# EAGLE design ReceiverShield (EAGLE 6.3)
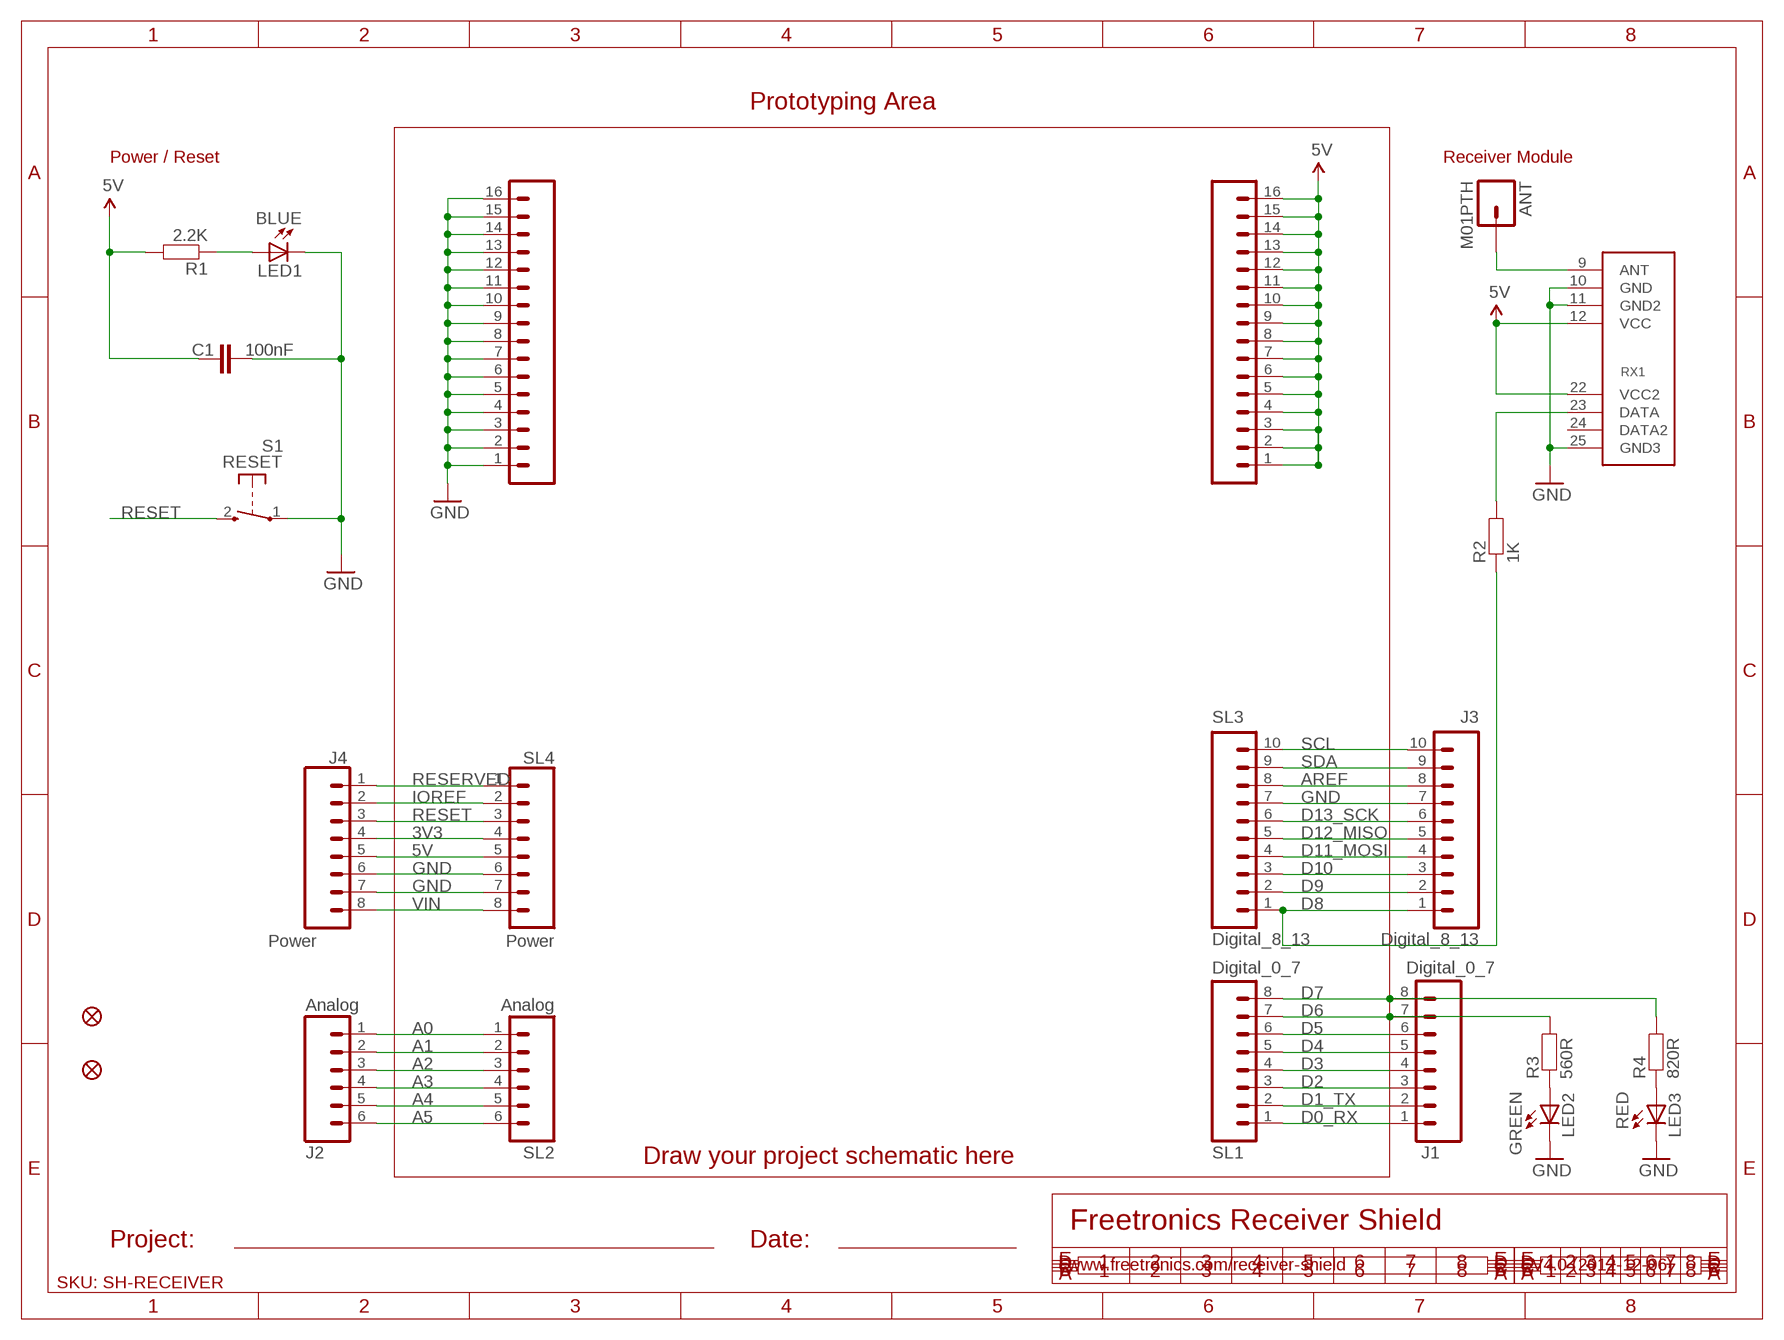
[diagram p0: schematic, sheet 1]

## Parts
ANT  M01PTH  [1X01]
C1  100nF  CAP0603  [0603]
J1  Digital_0_7  M08  [1X08]
J2  Analog  M06SIP  [1X06]
J3  Digital_8_13  M100.1  [1X10]
J4  Power  M08  [1X08]
LED1  BLUE  LED0603  [LED-0603]
LED2  GREEN  LED0603  [LED-0603]
LED3  RED  LED0603  [LED-0603]
PADS_5V  M16PTH  [1X16]
PADS_GND  M16PTH  [1X16]
R1  2.2K  RESISTOR0603  [0603]
R2  1K  RESISTOR0603  [0603]
R3  560R  RESISTOR0603  [0603]
R4  820R  RESISTOR0603  [0603]
RX1  RXB1SIL  [RX-B1]
S1  RESET  TAC_SWITCH_2PIN  [TACTILE_SWITCH_SMD_2PIN_TINY]
SL1  Digital_0_7  M08  [1X08]
SL2  Analog  M06SIP  [1X06]
SL3  Digital_8_13  M100.1  [1X10]
SL4  Power  M08  [1X08]
U$4  FIDUCIAL1X2.5  [FIDUCIAL-1X2.5]
U$5  FIDUCIAL1X2.5  [FIDUCIAL-1X2.5]

## Nets
3V3: J4.4 SL4.4
5V: C1.1 J4.5 PADS_5V.1 PADS_5V.2 PADS_5V.3 PADS_5V.4 PADS_5V.5 PADS_5V.6 PADS_5V.7 PADS_5V.8 PADS_5V.9 PADS_5V.10 PADS_5V.11 PADS_5V.12 PADS_5V.13 PADS_5V.14 PADS_5V.15 PADS_5V.16 R1.2 RX1.12(VCC) RX1.22(VCC2) SL4.5
A0: J2.1 SL2.1
A1: J2.2 SL2.2
A2: J2.3 SL2.3
A3: J2.4 SL2.4
A4: J2.5 SL2.5
A5: J2.6 SL2.6
AREF: J3.8 SL3.8
D0_RX: J1.1 SL1.1
D1_TX: J1.2 SL1.2
D2: J1.3 SL1.3
D3: J1.4 SL1.4
D4: J1.5 SL1.5
D5: J1.6 SL1.6
D6: J1.7 R3.2 SL1.7
D7: J1.8 R4.2 SL1.8
D8: J3.1 R2.1 SL3.1
D9: J3.2 SL3.2
D10: J3.3 SL3.3
D11_MOSI: J3.4 SL3.4
D12_MISO: J3.5 SL3.5
D13_SCK: J3.6 SL3.6
GND: C1.2 J3.7 J4.6 J4.7 LED1.C LED2.C LED3.C PADS_GND.1 PADS_GND.2 PADS_GND.3 PADS_GND.4 PADS_GND.5 PADS_GND.6 PADS_GND.7 PADS_GND.8 PADS_GND.9 PADS_GND.10 PADS_GND.11 PADS_GND.12 PADS_GND.13 PADS_GND.14 PADS_GND.15 PADS_GND.16 RX1.10(GND) RX1.11(GND2) RX1.25(GND3) S1.1(P) SL3.7 SL4.6 SL4.7
IOREF: J4.2 SL4.2
N$1: LED1.A R1.1
N$2: LED2.A R3.1
N$3: LED3.A R4.1
N$6: ANT.1 RX1.9(ANT)
N$135: R2.2 RX1.23(DATA)
RESERVED: J4.1 SL4.1
RESET: J4.3 S1.2(S) SL4.3
SCL: J3.10 SL3.10
SDA: J3.9 SL3.9
VIN: J4.8 SL4.8
Unconnected: RX1.24(DATA2)

## Notes on the sheet
- Prototyping Area
- Power / Reset | Receiver Module
- Draw your project schematic here
- Freetronics Receiver Shield
- Project: | Date:
- www.freetronics.com/receiver-shield | V4.0 (2012-12-06)
- SKU: SH-RECEIVER

## Library data of the parts
ANT = freetronics:M01: Header 1 Standard 1-pin 0.1" header. Use with straight break away headers (SKU : PRT-00116), right angle break away headers (PRT-00553), swiss pins (PRT-00743), machine pins (PRT-00117), and female headers (PRT-00115).
C1 = freetronics:CAP: Capacitor Standard 0603 ceramic capacitor, and 0.1" leaded capacitor.
J1 J4 SL1 SL4 = freetronics:M08: Header 8 Standard 8-pin 0.1" header. Use with straight break away headers (SKU : PRT-00116), right angle break away headers (PRT-00553), swiss pins (PRT-00743), machine pins (PRT-00117), and female headers (PRT-00115).
J2 SL2 = freetronics:M06: Header 6 Standard 6-pin 0.1" header. Use with straight break away headers (SKU : PRT-00116), right angle break away headers (PRT-00553), swiss pins (PRT-00743), machine pins (PRT-00117), and female headers (PRT-00115). Molex polarized connector foot print use with SKU : PRT-08094 with associated crimp pins and housings. NOTES ON THE VARIANTS LOCK and LOCK_LONGPADS... This footprint was designed to help hold the alignment of a through-hole component (i.e. 6-pin header) while soldering it into place. You may notice that each hole has been shifted either up or down by 0.005 of an inch from it's more standard position (which is a perfectly straight line). This slight alteration caused the pins (the squares in the middle) to touch the edges of the holes. Because they are alternating, it causes a "brace" to hold the component in place. 0.005 has proven to be the perfect amount of "off-center" position when using our standard breakaway headers. Although looks a little odd when you look at the bare footprint, once you have a header in there, the alteration is very hard to notice. Also, if you push a header all the way into place, it is covered up entirely on the bottom side. This idea of altering the position of holes to aid alignment will be further integrated into the Sparkfun Library for other footprints. It can help hold any component with 3 or more connection pins.
J3 SL3 = freetronics-original:M10: Header 10 Standard 10-pin 0.1" header. Use with straight break away headers (SKU : PRT-00116), right angle break away headers (PRT-00553), swiss pins (PRT-00743), machine pins (PRT-00117), and female headers (PRT-00115).
LED1-LED3 = freetronics:LED: LEDs Standard schematic elements and footprints for 5mm, 3mm, 1206, and 0603 sized LEDs. 5mm - Spark Fun Electronics SKU : COM-00529 (and others)
PADS_5V PADS_GND = freetronics-2:M16
R1-R4 = freetronics:RESISTOR: Resistor Basic schematic elements and footprints for 0603, 1206, and PTH 1/10th watt (small) resistors.
RX1 = PracticalArduino:RXB1
S1 = freetronics-master-v1:TAC_SWITCH_2PIN: Momentary Tactile Switch - 2 pin
U$4 U$5 = freetronics-original:FIDUCIAL: Fiducial Alignment Points Various fiducial points for machine vision alignment.

## Board
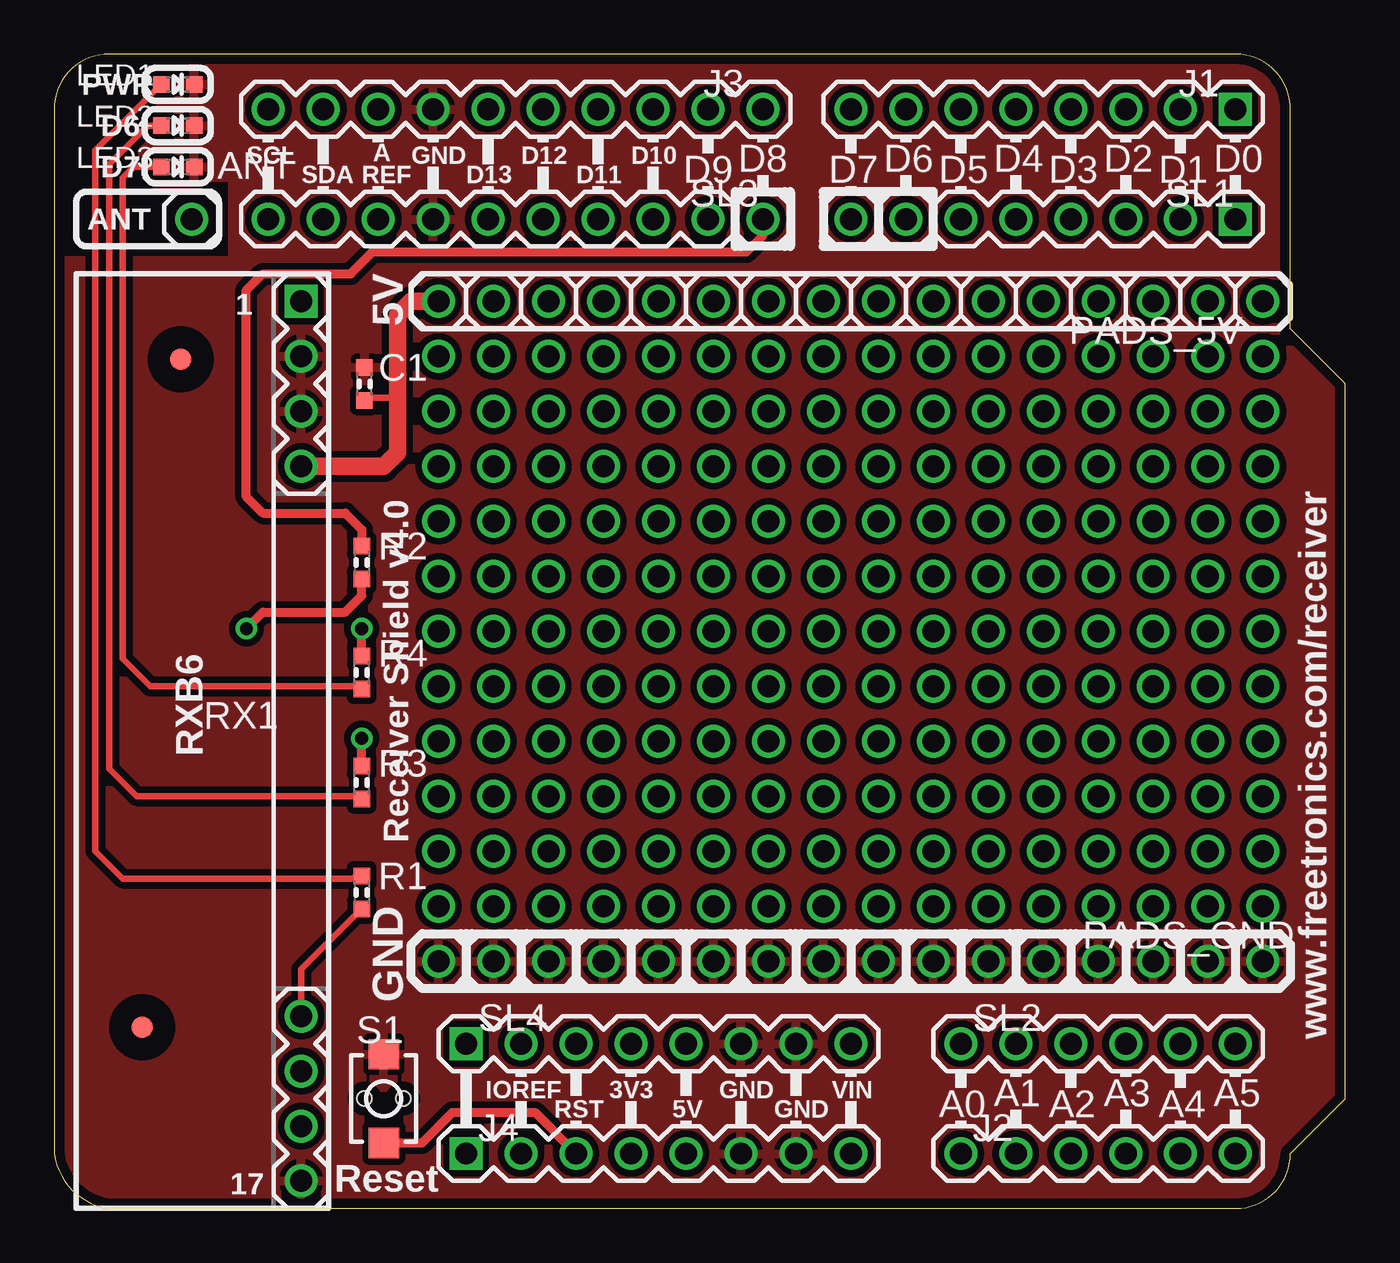
[diagram p1: board, top side]
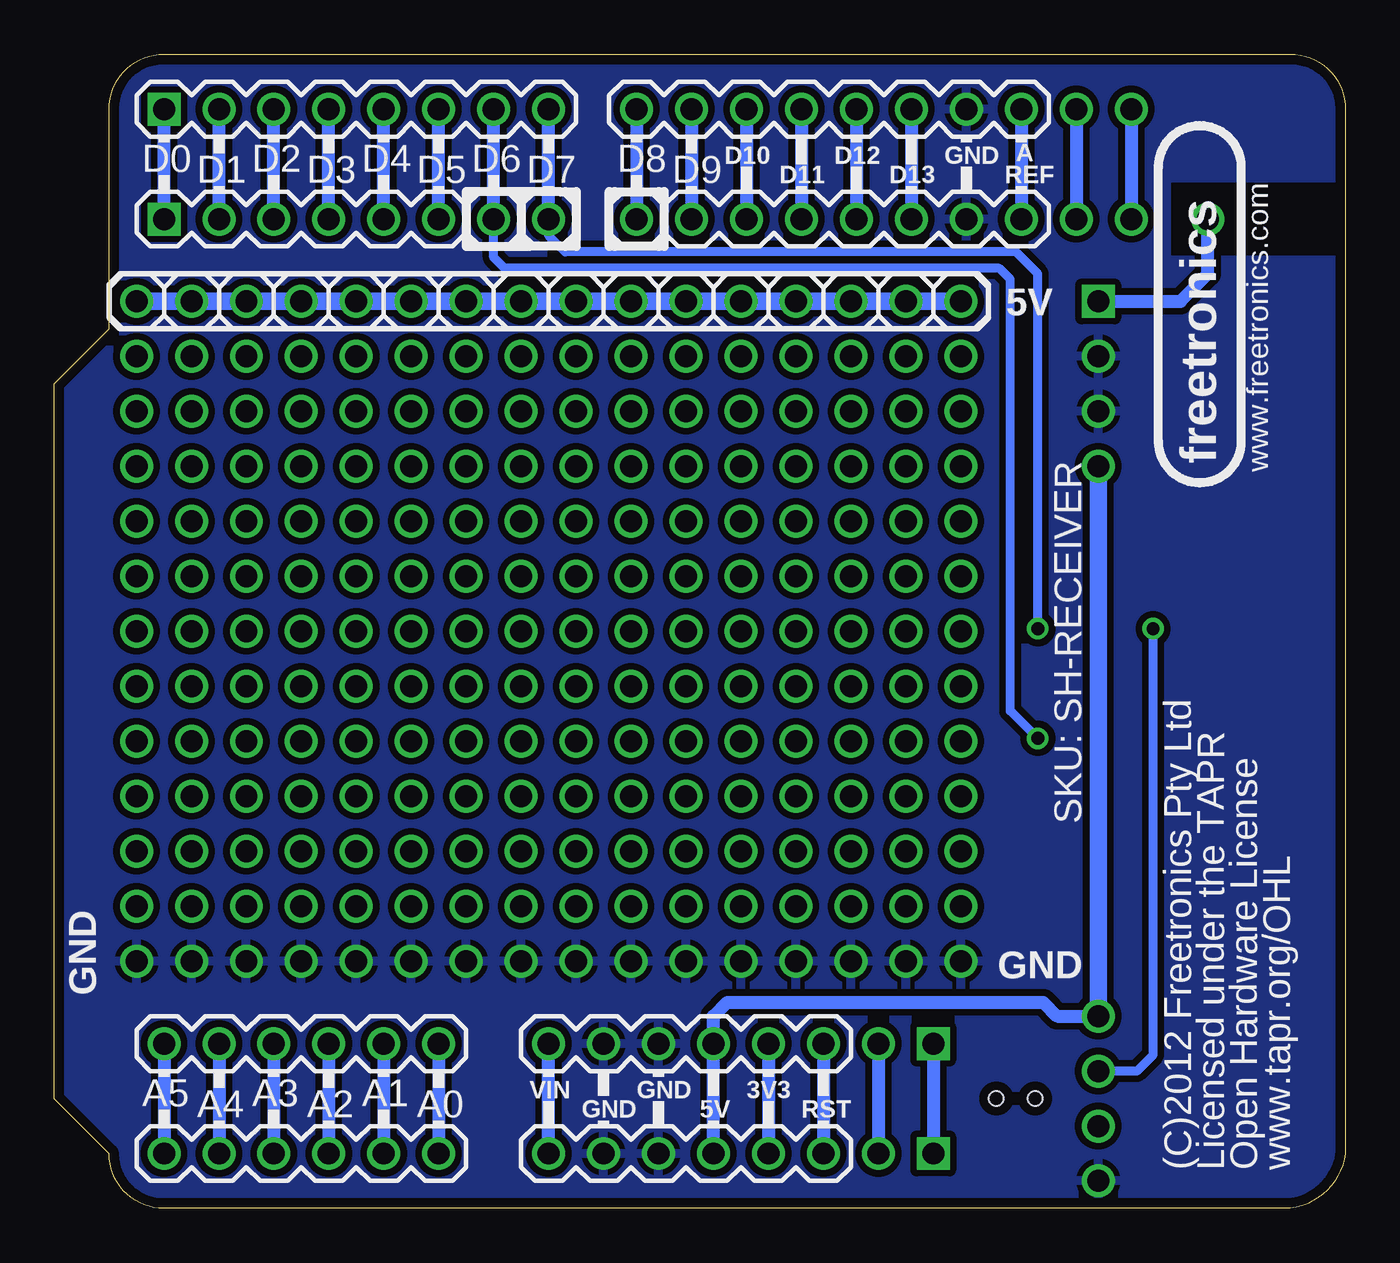
[diagram p2: board, bottom side, seen from below]

Size 59.69 x 53.34 mm. Coordinates in mm from the lower left corner, seen from the top.
Outline: 0,2.54 arc74 2.54,0 54.61,0 arc90 57.15,2.54 59.69,5.08 59.69,38.1 57.15,40.64 57.15,50.8 arc90 54.61,53.34 2.54,53.34 arc90 0,50.8 0,2.54
Copper layers (1*16): Top 0.035mm / dielectric 1.5mm / Bottom 0.035mm
Design rules "default *": minimum track width 10mil, minimum drill 24mil, track to track 12mil, track to pad 12mil, pad to pad 12mil, via to via 12mil, smd to smd 8mil, copper to edge 18mil, drill to drill 8mil, minimum pad ring 10mil, minimum via ring 8mil, stop-mask expansion 4mil, vias tented up to drill 0mil, thermal gap 10mil
tRestrict: area 4.8,38.2 to 6.9,40.3; area 3,7.4 to 5.1,9.4

### Footprints (pad centres in the part's own frame; a part is rotated, then mirrored left to right if it is on the bottom)
1X01 = drill 1.016: 1 0,0
0603 = smd 0.762 x 0.762: 1 -0.762,0; 2 0.762,0
1X08 = drill 1.016 square: 1 0,0 | drill 1.016: 2 2.54,0; 3 5.08,0; 4 7.62,0; 5 10.16,0; 6 12.7,0; 7 15.24,0; 8 17.78,0
1X06 = drill 1.016: 1 0,0; 2 2.54,0; 3 5.08,0; 4 7.62,0; 5 10.16,0; 6 12.7,0
1X10 = drill 1.016: 1 0,0; 2 2.54,0; 3 5.08,0; 4 7.62,0; 5 10.16,0; 6 12.7,0; 7 15.24,0; 8 17.78,0; 9 20.32,0; 10 22.86,0
LED-0603 = smd 0.762 x 0.762: A -0.762,0; C 0.762,0
1X16 = drill 1.016: 1 0,0; 2 2.54,0; 3 5.08,0; 4 7.62,0; 5 10.16,0; 6 12.7,0; 7 15.24,0; 8 17.78,0; 9 20.32,0; 10 22.86,0; 11 25.4,0; 12 27.94,0; 13 30.48,0; 14 33.02,0; 15 35.56,0; 16 38.1,0
RX-B1 = drill 1.016 square: 9 -19.05,0 | drill 1.016: 10 -16.51,0; 11 -13.97,0; 12 -11.43,0; 22 13.97,0; 23 16.51,0; 24 19.05,0; 25 21.59,0
TACTILE_SWITCH_SMD_2PIN_TINY = smd 1.4 x 1.4: 1 -2.05,0; 2 2.05,0 | hole 0.65: 0,0.9; 0,-0.9
FIDUCIAL-1X2.5 = smd 1 x 1: 1 0,0

### Placement (x,y rotation side)
ANT  6.35,45.72 0 top
C1  14.35,38.1 90 top
J1  54.61,50.8 180 top
J2  41.91,2.54 0 top
J3  32.77,50.8 180 top
J4  19.05,2.54 0 top
LED1  5.71,51.94 0 top
LED2  5.71,50.04 0 top
LED3  5.71,48.13 0 top
PADS_5V  55.88,41.91 180 top
PADS_GND  55.88,11.43 180 top
R1  14.22,14.61 270 top
R2  14.22,29.84 270 top
R3  14.22,19.68 90 top
R4  14.22,24.77 90 top
RX1  11.43,22.86 270 top
S1  15.24,5.08 270 top
SL1  54.61,45.72 180 top
SL2  41.91,7.62 0 top
SL3  32.77,45.72 180 top
SL4  19.05,7.62 0 top
U$4  5.84,39.24 0 top
U$5  4.06,8.38 0 top

### Tracks (layer width: path | path; a pad name or v marks a point on that pad's centre or on a via)
3V3
  Bottom 0.61: SL4.4 J4.4
5V
  Top 0.305: R1.2 11.43,11.05 RX1.22 | C1.1 14.48,37.47 15.88,37.47
  Top 0.813: RX1.12 15.24,34.29 15.88,34.92 15.88,37.47 15.88,41.27 16.51,41.91 PADS_5V.16
  Bottom 0.61: J4.5 SL4.5 29.21,8.89 28.57,9.53 13.97,9.53 13.34,8.89 RX1.22
  Bottom 0.813: PADS_5V.16 PADS_5V.15 PADS_5V.14 PADS_5V.13 PADS_5V.12 PADS_5V.11 PADS_5V.10 PADS_5V.9 PADS_5V.8 PADS_5V.7 PADS_5V.6 PADS_5V.5 PADS_5V.4 PADS_5V.3 PADS_5V.2 PADS_5V.1 | RX1.22 RX1.12
A0
  Bottom 0.61: SL2.1 J2.1
A1
  Bottom 0.61: SL2.2 J2.2
A2
  Bottom 0.61: SL2.3 J2.3
A3
  Bottom 0.61: SL2.4 J2.4
A4
  Bottom 0.61: SL2.5 J2.5
A5
  Bottom 0.61: SL2.6 J2.6
AREF
  Bottom 0.61: J3.8 SL3.8
D0_RX
  Bottom 0.61: SL1.1 J1.1
D1_TX
  Bottom 0.61: SL1.2 J1.2
D2
  Bottom 0.61: SL1.3 J1.3
D3
  Bottom 0.61: SL1.4 J1.4
D4
  Bottom 0.61: SL1.5 J1.5
D5
  Bottom 0.61: SL1.6 J1.6
D6  (via drill 0.6)
  Top 0.406: R3.2 v14.22,21.72
  Bottom 0.406: SL1.7 39.37,43.94 38.86,43.43 16,43.43 15.49,42.93 15.49,22.99 v14.22,21.72
  Bottom 0.61: SL1.7 J1.7
D7  (via drill 0.6)
  Top 0.406: R4.2 v14.22,26.8
  Bottom 0.406: v14.22,26.8 14.22,43.18 15.24,44.2 36.07,44.2 36.83,44.96 SL1.8
  Bottom 0.61: SL1.8 J1.8
D8
  Top 0.406: R2.1 14.22,31.37 13.46,32.13 9.65,32.13 8.89,32.89 8.89,42.42 9.65,43.18 13.72,43.18 14.73,44.2 32,44.2 32.77,44.96 SL3.1
  Bottom 0.61: J3.1 SL3.1
D9
  Bottom 0.61: J3.2 SL3.2
D10
  Bottom 0.61: J3.3 SL3.3
D11_MOSI
  Bottom 0.61: J3.4 SL3.4
D12_MISO
  Bottom 0.61: J3.5 SL3.5
D13_SCK
  Bottom 0.61: J3.6 SL3.6
GND
  pour Bottom: 0,43.81 8.26,43.81 8.26,47.62 0,47.62 0,50.8 arc-90 2.54,53.34 54.61,53.34 arc-74 57.15,50.8 57.15,40.64 59.69,38.1 59.69,5.08 57.15,2.54 arc-74 54.61,0 2.54,0 arc-74 0,2.54
  pour Top: 0,43.81 8.26,43.81 8.26,47.62 0,47.62 0,50.8 arc-90 2.54,53.34 54.61,53.34 arc-74 57.15,50.8 57.15,40.64 59.69,38.1 59.69,5.08 57.15,2.54 arc-74 54.61,0 2.54,0 arc-74 0,2.54
IOREF
  Bottom 0.61: SL4.2 J4.2
N$1
  Top 0.305: LED1.A 1.91,48.9 1.91,16.51 3.17,15.24 13.72,15.24 R1.1
N$2
  Top 0.305: LED2.A 4.32,50.04 2.54,48.26 2.54,20.32 3.81,19.05 14.1,19.05 R3.1
N$3
  Top 0.305: LED3.A 3.68,48.13 3.17,47.62 3.17,25.4 4.45,24.13 14.1,24.13 R4.1
N$4  (via drill 1.02)
  other vias: 50.8,34.29
N$5  (via drill 1.02)
  other vias: 50.8,13.97
N$6
  Bottom 0.61: RX1.9 7.62,41.91 6.35,43.18 ANT.1
N$7  (via drill 1.02)
  other vias: 48.26,13.97
N$8  (via drill 1.02)
  other vias: 45.72,13.97
N$9  (via drill 1.02)
  other vias: 43.18,13.97
N$10  (via drill 1.02)
  other vias: 40.64,13.97
N$11  (via drill 1.02)
  other vias: 38.1,13.97
N$12  (via drill 1.02)
  other vias: 35.56,13.97
N$13  (via drill 1.02)
  other vias: 33.02,13.97
N$14  (via drill 1.02)
  other vias: 30.48,13.97
N$15  (via drill 1.02)
  other vias: 27.94,13.97
N$16  (via drill 1.02)
  other vias: 25.4,13.97
N$17  (via drill 1.02)
  other vias: 22.86,13.97
N$18  (via drill 1.02)
  other vias: 20.32,13.97
N$19  (via drill 1.02)
  other vias: 17.78,13.97
N$22  (via drill 1.02)
  other vias: 50.8,16.51
N$23  (via drill 1.02)
  other vias: 48.26,16.51
N$24  (via drill 1.02)
  other vias: 45.72,16.51
N$25  (via drill 1.02)
  other vias: 43.18,16.51
N$26  (via drill 1.02)
  other vias: 40.64,16.51
N$27  (via drill 1.02)
  other vias: 38.1,16.51
N$28  (via drill 1.02)
  other vias: 35.56,16.51
N$29  (via drill 1.02)
  other vias: 33.02,16.51
N$30  (via drill 1.02)
  other vias: 30.48,16.51
N$31  (via drill 1.02)
  other vias: 27.94,16.51
N$32  (via drill 1.02)
  other vias: 25.4,16.51
N$33  (via drill 1.02)
  other vias: 22.86,16.51
N$34  (via drill 1.02)
  other vias: 20.32,16.51
N$35  (via drill 1.02)
  other vias: 17.78,16.51
N$38  (via drill 1.02)
  other vias: 50.8,19.05
N$39  (via drill 1.02)
  other vias: 48.26,19.05
N$40  (via drill 1.02)
  other vias: 45.72,19.05
N$41  (via drill 1.02)
  other vias: 43.18,19.05
N$42  (via drill 1.02)
  other vias: 40.64,19.05
N$43  (via drill 1.02)
  other vias: 38.1,19.05
N$44  (via drill 1.02)
  other vias: 35.56,19.05
N$45  (via drill 1.02)
  other vias: 33.02,19.05
N$46  (via drill 1.02)
  other vias: 30.48,19.05
N$47  (via drill 1.02)
  other vias: 27.94,19.05
N$48  (via drill 1.02)
  other vias: 25.4,19.05
N$49  (via drill 1.02)
  other vias: 22.86,19.05
N$50  (via drill 1.02)
  other vias: 20.32,19.05
N$51  (via drill 1.02)
  other vias: 17.78,19.05
N$54  (via drill 1.02)
  other vias: 50.8,21.59
N$55  (via drill 1.02)
  other vias: 48.26,21.59
N$56  (via drill 1.02)
  other vias: 45.72,21.59
N$57  (via drill 1.02)
  other vias: 43.18,21.59
N$58  (via drill 1.02)
  other vias: 40.64,21.59
N$59  (via drill 1.02)
  other vias: 38.1,21.59
N$60  (via drill 1.02)
  other vias: 35.56,21.59
N$61  (via drill 1.02)
  other vias: 33.02,21.59
N$62  (via drill 1.02)
  other vias: 30.48,21.59
N$63  (via drill 1.02)
  other vias: 27.94,21.59
N$64  (via drill 1.02)
  other vias: 25.4,21.59
N$65  (via drill 1.02)
  other vias: 22.86,21.59
N$66  (via drill 1.02)
  other vias: 20.32,21.59
N$67  (via drill 1.02)
  other vias: 17.78,21.59
N$70  (via drill 1.02)
  other vias: 50.8,24.13
N$71  (via drill 1.02)
  other vias: 48.26,24.13
N$72  (via drill 1.02)
  other vias: 45.72,24.13
N$73  (via drill 1.02)
  other vias: 43.18,24.13
N$74  (via drill 1.02)
  other vias: 40.64,24.13
N$75  (via drill 1.02)
  other vias: 38.1,24.13
N$76  (via drill 1.02)
  other vias: 35.56,24.13
N$77  (via drill 1.02)
  other vias: 33.02,24.13
N$78  (via drill 1.02)
  other vias: 30.48,24.13
N$79  (via drill 1.02)
  other vias: 27.94,24.13
N$80  (via drill 1.02)
  other vias: 25.4,24.13
N$81  (via drill 1.02)
  other vias: 22.86,24.13
N$82  (via drill 1.02)
  other vias: 20.32,24.13
N$83  (via drill 1.02)
  other vias: 17.78,24.13
N$86  (via drill 1.02)
  other vias: 50.8,26.67
N$87  (via drill 1.02)
  other vias: 48.26,26.67
N$88  (via drill 1.02)
  other vias: 45.72,26.67
N$89  (via drill 1.02)
  other vias: 43.18,26.67
N$90  (via drill 1.02)
  other vias: 40.64,26.67
N$91  (via drill 1.02)
  other vias: 38.1,26.67
N$92  (via drill 1.02)
  other vias: 35.56,26.67
N$93  (via drill 1.02)
  other vias: 33.02,26.67
N$94  (via drill 1.02)
  other vias: 30.48,26.67
N$95  (via drill 1.02)
  other vias: 27.94,26.67
N$96  (via drill 1.02)
  other vias: 25.4,26.67
N$97  (via drill 1.02)
  other vias: 22.86,26.67
N$98  (via drill 1.02)
  other vias: 20.32,26.67
N$99  (via drill 1.02)
  other vias: 17.78,26.67
N$102  (via drill 1.02)
  other vias: 50.8,29.21
N$103  (via drill 1.02)
  other vias: 48.26,29.21
N$104  (via drill 1.02)
  other vias: 45.72,29.21
N$105  (via drill 1.02)
  other vias: 43.18,29.21
N$106  (via drill 1.02)
  other vias: 40.64,29.21
N$107  (via drill 1.02)
  other vias: 38.1,29.21
N$108  (via drill 1.02)
  other vias: 35.56,29.21
N$109  (via drill 1.02)
  other vias: 33.02,29.21
N$110  (via drill 1.02)
  other vias: 30.48,29.21
N$111  (via drill 1.02)
  other vias: 27.94,29.21
N$112  (via drill 1.02)
  other vias: 25.4,29.21
N$113  (via drill 1.02)
  other vias: 22.86,29.21
N$114  (via drill 1.02)
  other vias: 20.32,29.21
N$115  (via drill 1.02)
  other vias: 17.78,29.21
N$118  (via drill 1.02)
  other vias: 50.8,31.75
N$119  (via drill 1.02)
  other vias: 48.26,31.75
N$120  (via drill 1.02)
  other vias: 45.72,31.75
N$121  (via drill 1.02)
  other vias: 43.18,31.75
N$122  (via drill 1.02)
  other vias: 40.64,31.75
N$123  (via drill 1.02)
  other vias: 38.1,31.75
N$124  (via drill 1.02)
  other vias: 35.56,31.75
N$125  (via drill 1.02)
  other vias: 33.02,31.75
N$126  (via drill 1.02)
  other vias: 30.48,31.75
N$127  (via drill 1.02)
  other vias: 27.94,31.75
N$128  (via drill 1.02)
  other vias: 25.4,31.75
N$129  (via drill 1.02)
  other vias: 22.86,31.75
N$130  (via drill 1.02)
  other vias: 20.32,31.75
N$131  (via drill 1.02)
  other vias: 17.78,31.75
N$134  (via drill 1.02)
  other vias: 48.26,34.29
N$135  (via drill 0.6)
  Top 0.406: v8.89,26.8 9.65,27.56 13.46,27.56 14.22,28.32 R2.2
  Bottom 0.406: RX1.23 9.65,6.35 8.89,7.11 v8.89,26.8
N$136  (via drill 1.02)
  other vias: 45.72,34.29
N$137  (via drill 1.02)
  other vias: 43.18,34.29
N$138  (via drill 1.02)
  other vias: 40.64,34.29
N$139  (via drill 1.02)
  other vias: 38.1,34.29
N$140  (via drill 1.02)
  other vias: 35.56,34.29
N$141  (via drill 1.02)
  other vias: 33.02,34.29
N$142  (via drill 1.02)
  other vias: 30.48,34.29
N$143  (via drill 1.02)
  other vias: 50.8,36.83
N$144  (via drill 1.02)
  other vias: 48.26,36.83
N$145  (via drill 1.02)
  other vias: 45.72,36.83
N$146  (via drill 1.02)
  other vias: 43.18,36.83
N$147  (via drill 1.02)
  other vias: 40.64,36.83
N$148  (via drill 1.02)
  other vias: 38.1,36.83
N$149  (via drill 1.02)
  other vias: 35.56,36.83
N$150  (via drill 1.02)
  other vias: 33.02,36.83
N$151  (via drill 1.02)
  other vias: 30.48,36.83
N$152  (via drill 1.02)
  other vias: 50.8,39.37
N$153  (via drill 1.02)
  other vias: 48.26,39.37
N$154  (via drill 1.02)
  other vias: 45.72,39.37
N$155  (via drill 1.02)
  other vias: 43.18,39.37
N$156  (via drill 1.02)
  other vias: 40.64,39.37
N$157  (via drill 1.02)
  other vias: 38.1,39.37
N$158  (via drill 1.02)
  other vias: 35.56,39.37
N$159  (via drill 1.02)
  other vias: 33.02,39.37
N$160  (via drill 1.02)
  other vias: 30.48,39.37
N$161  (via drill 1.02)
  other vias: 53.34,34.29
N$162  (via drill 1.02)
  other vias: 53.34,36.83
N$163  (via drill 1.02)
  other vias: 53.34,39.37
N$164  (via drill 1.02)
  other vias: 55.88,34.29
N$165  (via drill 1.02)
  other vias: 55.88,36.83
N$166  (via drill 1.02)
  other vias: 55.88,39.37
N$167  (via drill 1.02)
  other vias: 27.94,34.29
N$168  (via drill 1.02)
  other vias: 25.4,34.29
N$169  (via drill 1.02)
  other vias: 22.86,34.29
N$170  (via drill 1.02)
  other vias: 20.32,34.29
N$171  (via drill 1.02)
  other vias: 17.78,34.29
N$172  (via drill 1.02)
  other vias: 27.94,36.83
N$173  (via drill 1.02)
  other vias: 25.4,36.83
N$174  (via drill 1.02)
  other vias: 22.86,36.83
N$175  (via drill 1.02)
  other vias: 20.32,36.83
N$176  (via drill 1.02)
  other vias: 17.78,36.83
N$177  (via drill 1.02)
  other vias: 27.94,39.37
N$178  (via drill 1.02)
  other vias: 25.4,39.37
N$179  (via drill 1.02)
  other vias: 22.86,39.37
N$180  (via drill 1.02)
  other vias: 20.32,39.37
N$181  (via drill 1.02)
  other vias: 17.78,39.37
N$182  (via drill 1.02)
  other vias: 53.34,13.97
N$183  (via drill 1.02)
  other vias: 53.34,16.51
N$184  (via drill 1.02)
  other vias: 53.34,19.05
N$185  (via drill 1.02)
  other vias: 53.34,21.59
N$186  (via drill 1.02)
  other vias: 53.34,24.13
N$187  (via drill 1.02)
  other vias: 53.34,26.67
N$188  (via drill 1.02)
  other vias: 53.34,29.21
N$189  (via drill 1.02)
  other vias: 53.34,31.75
N$193  (via drill 1.02)
  other vias: 55.88,13.97
N$194  (via drill 1.02)
  other vias: 55.88,16.51
N$195  (via drill 1.02)
  other vias: 55.88,19.05
N$196  (via drill 1.02)
  other vias: 55.88,21.59
N$197  (via drill 1.02)
  other vias: 55.88,24.13
N$198  (via drill 1.02)
  other vias: 55.88,26.67
N$199  (via drill 1.02)
  other vias: 55.88,29.21
N$200  (via drill 1.02)
  other vias: 55.88,31.75
RESERVED
  Bottom 0.61: SL4.1 J4.1
RESET
  Top 0.406: S1.2 17,3.03 18.41,4.45 22.23,4.45 J4.3
  Bottom 0.61: SL4.3 J4.3
SCL
  Bottom 0.61: J3.10 SL3.10
SDA
  Bottom 0.61: J3.9 SL3.9
VIN
  Bottom 0.61: J4.8 SL4.8

### Text on the board
tPlace: PWR | D6 | D7 | SCL | A | GND | D12 | D10 | D8 | D6 | D4 | D2 | D0 | SDA | REF | D13 | D11 | D9 | D7 | D5 | D3 | D1 | ANT | 1 | 5V | RXB6 | Receiver Shield v4.0 | GND | www.freetronics.com/receiver | IOREF | 3V3 | GND | VIN | A1 | A3 | A5 | RST | 5V | GND | A0 | A2 | A4 | 17 | Reset
bPlace: A | GND | D12 | D10 | D8 | D6 | D4 | D2 | D0 | REF | D13 | D11 | D9 | D7 | D5 | D3 | D1 | 5V | www.freetronics.com | freetronics | SKU: SH-RECEIVER | GND | GND | 3V3 | GND | VIN | A1 | A3 | A5 | RST | 5V | GND | A0 | A2 | A4 | www.tapr.org/OHL | Open Hardware License | Licensed under the TAPR | (C)2012 Freetronics Pty Ltd
tNames: S1